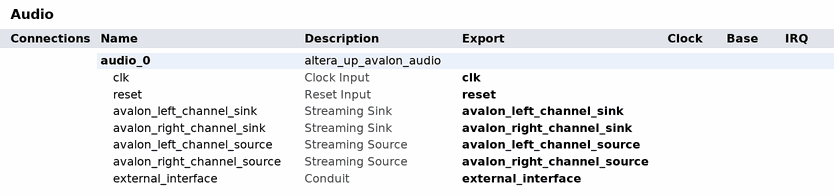
[diagram p0: system contents]
# Platform Designer (Qsys) system Audio, Cyclone V 5CSEMA5F31C6
# Parameters at their usual value, and those the tool derives, are not listed.
package require -exact qsys 17.1
create_system Audio
set_project_property DEVICE_FAMILY {Cyclone V}
set_project_property DEVICE 5CSEMA5F31C6

add_instance audio_0 altera_up_avalon_audio 17.1
set_instance_property audio_0 AUTO_EXPORT true
set_instance_parameter_value audio_0 audio_in false
set_instance_parameter_value audio_0 avalon_bus_type Streaming
set_instance_parameter_value audio_0 dw 32

# exported interfaces
add_interface avalon_left_channel_sink avalon_streaming sink
set_interface_property avalon_left_channel_sink EXPORT_OF audio_0.avalon_left_channel_sink
add_interface avalon_left_channel_source avalon_streaming source
set_interface_property avalon_left_channel_source EXPORT_OF audio_0.avalon_left_channel_source
add_interface avalon_right_channel_sink avalon_streaming sink
set_interface_property avalon_right_channel_sink EXPORT_OF audio_0.avalon_right_channel_sink
add_interface avalon_right_channel_source avalon_streaming source
set_interface_property avalon_right_channel_source EXPORT_OF audio_0.avalon_right_channel_source
add_interface clk clock sink
set_interface_property clk EXPORT_OF audio_0.clk
add_interface external_interface conduit end
set_interface_property external_interface EXPORT_OF audio_0.external_interface
add_interface reset reset sink
set_interface_property reset EXPORT_OF audio_0.reset

set_interconnect_requirement {$system} qsys_mm.clockCrossingAdapter HANDSHAKE
set_interconnect_requirement {$system} qsys_mm.enableEccProtection FALSE
set_interconnect_requirement {$system} qsys_mm.insertDefaultSlave FALSE
set_interconnect_requirement {$system} qsys_mm.maxAdditionalLatency 1

save_system Audio.qsys
